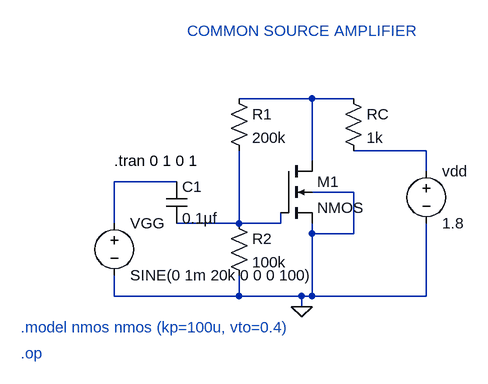
[diagram p0: schematic 10)common_source_amp.asc]
10)common_source_amp.asc, the LTspice schematic file:
Version 4
SHEET 1 880 680
WIRE 192 -16 80 -16
WIRE 256 -16 192 -16
WIRE 368 64 256 64
WIRE 192 80 192 -16
WIRE 368 96 368 64
WIRE -16 112 -112 112
WIRE 256 128 192 128
WIRE -112 176 -112 112
WIRE 80 176 80 64
WIRE 80 176 -16 176
WIRE 144 176 144 160
WIRE 144 176 80 176
WIRE 192 192 192 176
WIRE 256 192 256 128
WIRE 256 192 192 192
WIRE -112 288 -112 256
WIRE 80 288 80 256
WIRE 80 288 -112 288
WIRE 176 288 80 288
WIRE 192 288 192 192
WIRE 192 288 176 288
WIRE 368 288 368 176
WIRE 368 288 192 288
WIRE 176 304 176 288
FLAG 176 304 0
SYMBOL nmos4 144 80 R0
SYMATTR InstName M1
SYMBOL res 64 -32 R0
SYMATTR InstName R1
SYMATTR Value 200k
SYMBOL res 64 160 R0
SYMATTR InstName R2
SYMATTR Value 100k
SYMBOL res 240 -32 R0
SYMATTR InstName RC
SYMATTR Value 1k
SYMBOL cap -32 112 R0
SYMATTR InstName C1
SYMATTR Value 0.1µf
SYMBOL voltage -112 160 R0
WINDOW 123 0 0 Left 0
WINDOW 39 0 0 Left 0
SYMATTR InstName VGG
SYMATTR Value SINE(0 1m 20k 0 0 0 100)
SYMBOL voltage 368 80 R0
SYMATTR InstName vdd
SYMATTR Value 1.8
TEXT -256 336 Left 2 ;.model nmos nmos (kp=100u, vto=0.4)
TEXT -112 80 Left 2 !.tran 0 1 0 1
TEXT -256 376 Left 2 ;.op
TEXT 0 -120 Left 2 ;COMMON SOURCE AMPLIFIER

The netlist it stands for:
* 10)common_source_amp.asc
M1 N001 N004 0 0 NMOS
R1 N001 N004 200k
R2 N004 0 100k
RC N001 N002 1k
C1 N003 N004 0.1µf
VGG N003 0 SINE(0 1m 20k 0 0 0 100)
vdd N002 0 1.8
.model NMOS NMOS
.model PMOS PMOS
.lib standard.mos
* .model nmos nmos (kp=100u, vto=0.4)
.tran 0 1 0 1
* .op
* COMMON SOURCE AMPLIFIER
.backanno
.end